# Altium schematic sheet Sheet1.SchDoc
size 381 x 241 mm; SheetNumber: 1; SheetTotal: 5; SPICEModelCacheHRDCRIYR: <root> / <DocumentId>HRDCRIYR</DocumentId> / <CacheFrame Number="0"> / <Model Name="cap" Kind="MDL"> / <Text>*Default semiconductor capacitor / .MODEL CAP C()</Text> / </Model> / </CacheFrame> / </root>
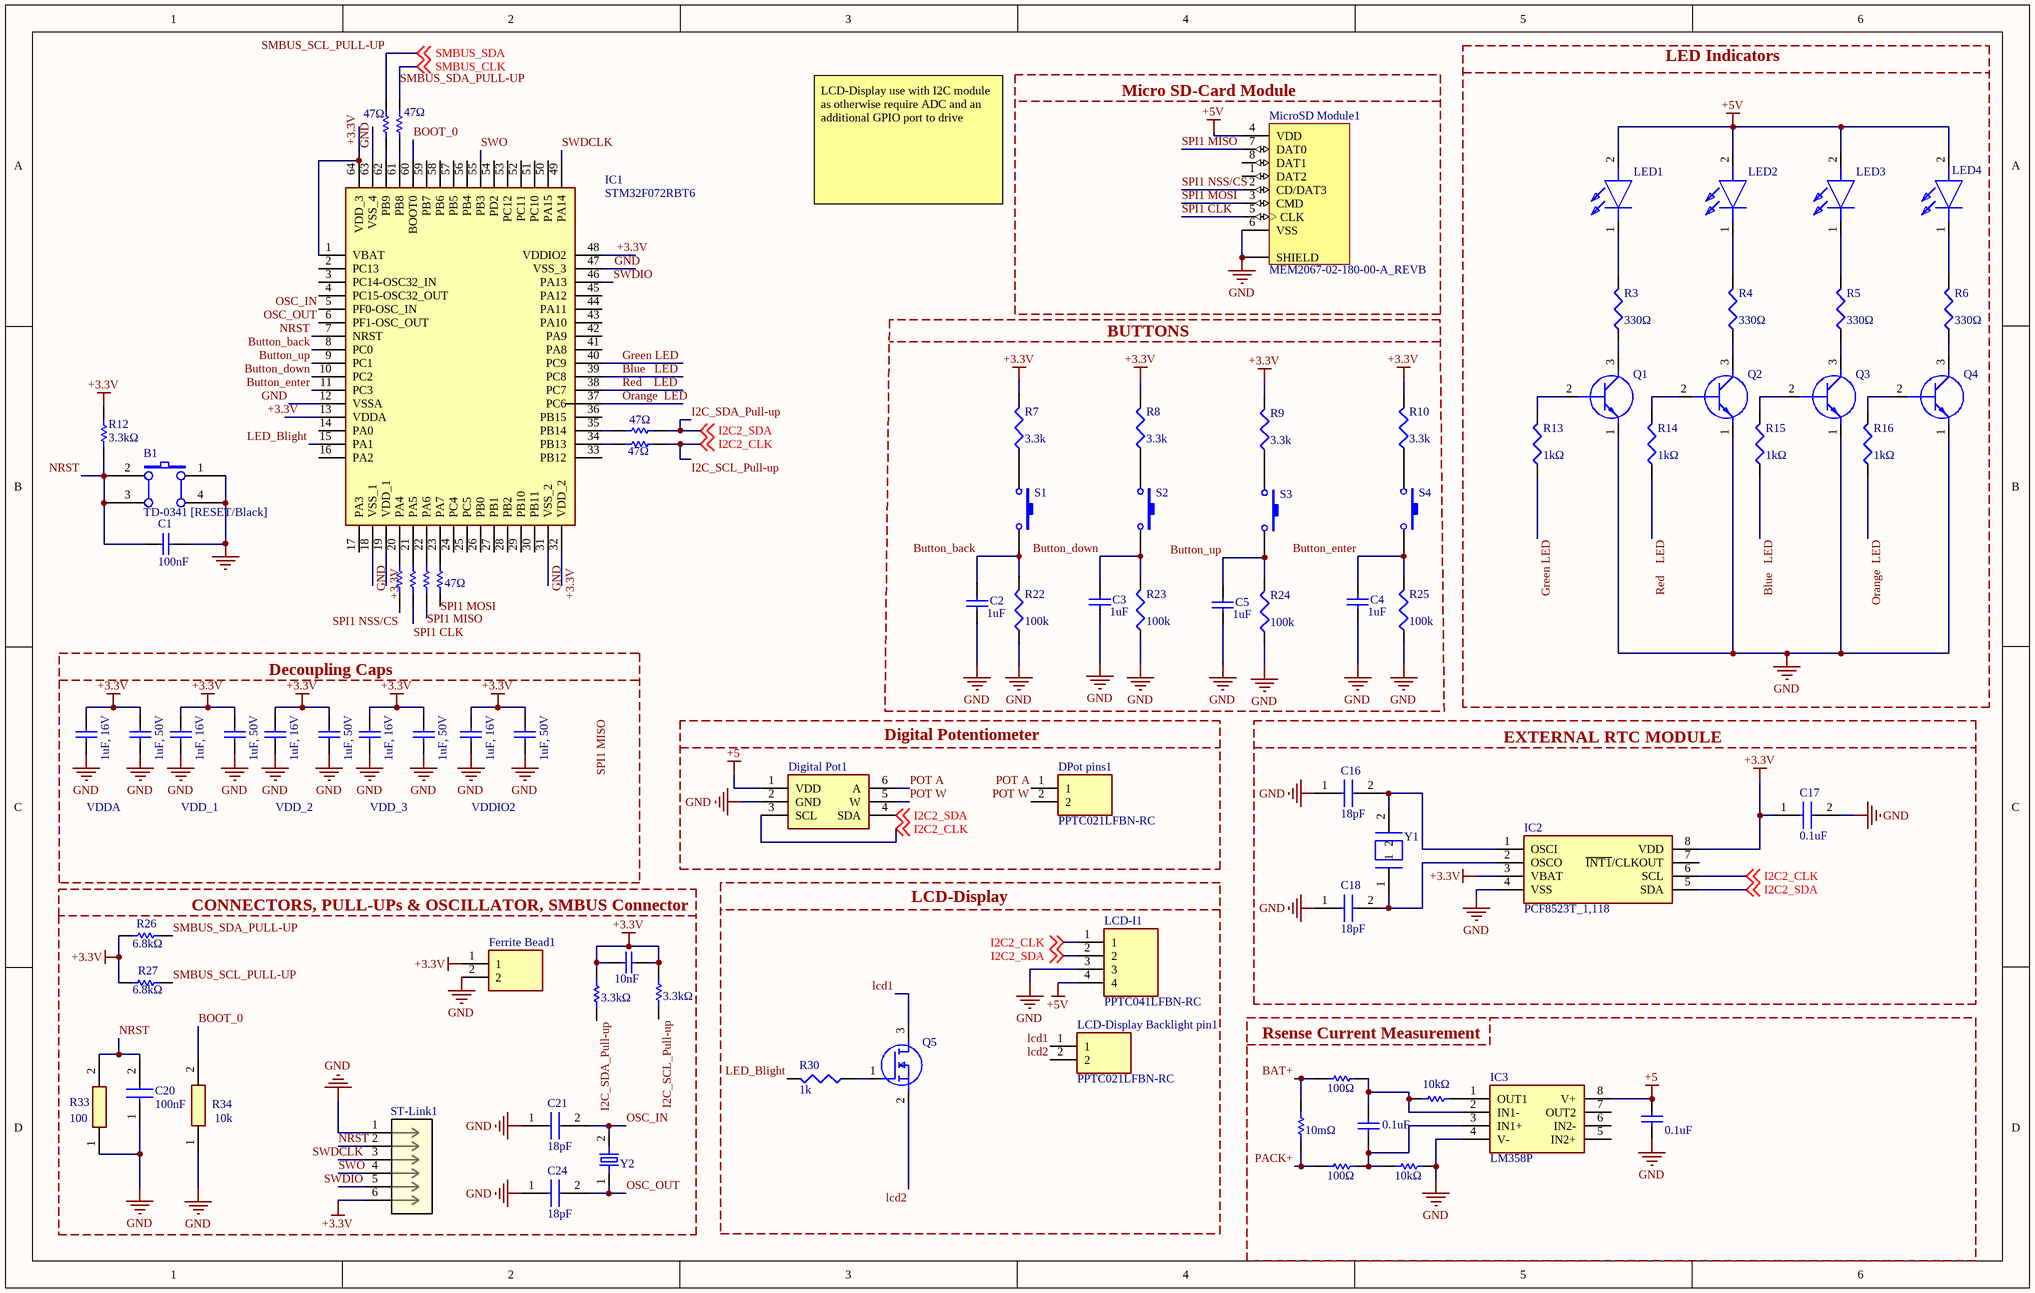
[diagram p0: Sheet1.SchDoc]

## Parts
B1  TD-0341 [RESET/Black]  [PB10]
C1  100nF  [0603C]
C2  value 1uF  [RAD-0.3]  (hidden comment: Cap)
C3  value 1uF  [RAD-0.3]  (hidden comment: Cap)
C4  value 1uF  [RAD-0.3]  (hidden comment: Cap)
C5  value 1uF  [RAD-0.3]  (hidden comment: Cap)
C6  value 1uF, 16V  [RAD-0.3]  (hidden comment: Cap)
C7  value 1uF, 50V  [RAD-0.3]  (hidden comment: Cap)
C8  value 1uF, 16V  [RAD-0.3]  (hidden comment: Cap)
C9  value 1uF, 50V  [RAD-0.3]  (hidden comment: Cap)
C10  value 1uF, 16V  [RAD-0.3]  (hidden comment: Cap)
C11  value 1uF, 50V  [RAD-0.3]  (hidden comment: Cap)
C12  value 1uF, 16V  [RAD-0.3]  (hidden comment: Cap)
C13  value 1uF, 50V  [RAD-0.3]  (hidden comment: Cap)
C14  value 1uF, 16V  [RAD-0.3]  (hidden comment: Cap)
C15  value 1uF, 50V  [RAD-0.3]  (hidden comment: Cap)
C16  18pF  [CAPC3216X180N]
C17  0.1uF  [CAPC3216X180N]
C18  18pF  [CAPC3216X180N]
C19  value 10nF  [RAD-0.3]  (hidden comment: Cap)
C20  100nF  [CAPC3216X180N]
C21  18pF  [CAPC3216X180N]
C22  value 0.1uF  [RAD-0.3]  (hidden comment: Cap)
C23  value 0.1uF  [RAD-0.3]  (hidden comment: Cap)
C24  18pF  [CAPC3216X180N]
Digital_Pot1  AD5247BKSZ10-2RL7  [SOT65P210X110-6N]  (value not drawn)
DPot_pins1  PPTC021LFBN-RC  [RHDR2W80P0X254_1X2_558X254X850P]
Ferrite_Bead1  2506033007Y3  [BEADC1608X110N]  (value not drawn)
IC1  STM32F072RBT6  [QFP50P1200X1200X160-64N]
IC2  PCF8523T_1,118  [SOIC127P600X175-8N]
IC3  LM358P  [DIP794W53P254L959H508Q8N]
LCD-Display_Backlight_pin1  PPTC021LFBN-RC  [RHDR2W80P0X254_1X2_558X254X850P]
LCD-I1  PPTC041LFBN-RC  [RHDR4W80P0X254_1X4_1066X254X850P]
LED1  L-424IDT  [T-1_(3MM)_CYLINDRICAL_LED_LAMP]  (value not drawn)
LED2  L-424IDT  [T-1_(3MM)_CYLINDRICAL_LED_LAMP]  (value not drawn)
LED3  L-424IDT  [T-1_(3MM)_CYLINDRICAL_LED_LAMP]  (value not drawn)
LED4  L-424IDT  [T-1_(3MM)_CYLINDRICAL_LED_LAMP]  (value not drawn)
MicroSD_Module1  MEM2067-02-180-00-A_REVB  [GCT_MEM2067-02-180-00-A_REVB]
Q1  2n3904  [TO-92]  (value not drawn)
Q2  2n3904  [TO-92]  (value not drawn)
Q3  2n3904  [TO-92]  (value not drawn)
Q4  2n3904  [TO-92]  (value not drawn)
Q5  DMG6968UQ-7  [SOT96P240X100-3N]  (value not drawn)
R1  value 47Ω  [AXIAL-0.3]  (hidden comment: Res1)
R2  value 47Ω  [AXIAL-0.3]  (hidden comment: Res1)
R3  value 330Ω  [J1-0603]  (hidden comment: 330)
R4  value 330Ω  [J1-0603]  (hidden comment: 330)
R5  value 330Ω  [J1-0603]  (hidden comment: 330)
R6  value 330Ω  [J1-0603]  (hidden comment: 330)
R7  value 3.3k  [J1-0603]  (hidden comment: Res3)
R8  value 3.3k  [J1-0603]  (hidden comment: Res3)
R9  value 3.3k  [J1-0603]  (hidden comment: Res3)
R10  value 3.3k  [J1-0603]  (hidden comment: Res3)
R11  value 47Ω  [AXIAL-0.3]  (hidden comment: Res1)
R12  value 3.3kΩ  [AXIAL-0.3]  (hidden comment: Res1)
R13  value 1kΩ  [J1-0603]  (hidden comment: Res3)
R14  value 1kΩ  [J1-0603]  (hidden comment: Res3)
R15  value 1kΩ  [J1-0603]  (hidden comment: Res3)
R16  value 1kΩ  [J1-0603]  (hidden comment: Res3)
R17  value 47Ω  [AXIAL-0.3]  (hidden comment: Res1)
R18  Res1  [AXIAL-0.3]  (value not drawn)
R19  Res1  [AXIAL-0.3]  (value not drawn)
R20  Res1  [AXIAL-0.3]  (value not drawn)
R21  value 47Ω  [AXIAL-0.3]  (hidden comment: Res1)
R22  value 100k  [J1-0603]  (hidden comment: Res3)
R23  value 100k  [J1-0603]  (hidden comment: Res3)
R24  value 100k  [J1-0603]  (hidden comment: Res3)
R25  value 100k  [J1-0603]  (hidden comment: Res3)
R26  value 6.8kΩ  [AXIAL-0.3]  (hidden comment: Res1)
R27  value 6.8kΩ  [AXIAL-0.3]  (hidden comment: Res1)
R28  value 3.3kΩ  [AXIAL-0.3]  (hidden comment: Res1)
R29  value 3.3kΩ  [AXIAL-0.3]  (hidden comment: Res1)
R30  value 1k  [J1-0603]  (hidden comment: Res3)
R31  value 100Ω  [AXIAL-0.3]  (hidden comment: Res1)
R32  value 10kΩ  [AXIAL-0.3]  (hidden comment: Res1)
R33  100  [RESC1608X55N]
R34  10k  [RESC1608X55N]
R35  value 10mΩ  [AXIAL-0.3]  (hidden comment: Res1)
R36  value 100Ω  [AXIAL-0.3]  (hidden comment: Res1)
R37  value 10kΩ  [AXIAL-0.3]  (hidden comment: Res1)
S1  SW-PB  [SPST-2]  (value not drawn)
S2  SW-PB  [SPST-2]  (value not drawn)
S3  SW-PB  [SPST-2]  (value not drawn)
S4  SW-PB  [SPST-2]  (value not drawn)
ST-Link1  20021121-00006C4LF  [CONN_20021121-00006C4LF_AMP-M]  (value not drawn)
Y1  ABS07AIG-32.768KHZ-9-1-T  [XTAL320X150X90]  (value not drawn)
Y2  8 MHz ±20ppm  [XTAL500X320X130N]  (value not drawn)

## Blocks framed on the sheet
LED Indicators: LED1-LED4 Q1-Q4 R3-R6 R13-R16
Micro SD-Card Module: MicroSD_Module1
BUTTONS: C2-C5 R7-R10 R22-R25 S1-S4
Decoupling Caps: C6-C15
Digital Potentiometer: Digital_Pot1 DPot_pins1
LCD-Display: LCD-Display_Backlight_pin1 LCD-I1 Q5 R30
CONNECTORS, PULL-UPs & OSCILLATOR, SMBUS Connector: C19-C21 C24 Ferrite_Bead1 R26-R29 R33 R34 ST-Link1 Y2

## Nets
+3.3V: C6.1 C7.1 C8.1 C9.1 C10.1 C11.1 C12.1 C13.1 C14.1 C15.1 C17.1 C19.1 C19.2 Ferrite_Bead1.1 IC1.1(VBAT) IC1.13(VDDA) IC1.19(VDD_1) IC1.32(VDD_2) IC1.48(VDDIO2) IC1.64(VDD_3) IC2.3(VBAT) IC2.8(VDD) R7.2 R8.2 R9.2 R10.2 R12.2 R26.1 R27.1 R28.1 R29.1 ST-Link1.6
+5: C22.1 Digital_Pot1.1(VDD) IC3.8(V+)
+5V: LCD-I1.4 LED1.2(A) LED2.2(A) LED3.2(A) LED4.2(A) MicroSD_Module1.4(VDD)
GND: B1.1(A0) B1.4(A1) C1.1 C2.1 C3.1 C4.1 C5.1 C6.2 C7.2 C8.2 C9.2 C10.2 C11.2 C12.2 C13.2 C14.2 C15.2 C16.1 C17.2 C18.1 C20.1 C21.1 C22.2 C24.1 Digital_Pot1.2(GND) Ferrite_Bead1.2 IC1.12(VSSA) IC1.18(VSS_1) IC1.31(VSS_2) IC1.47(VSS_3) IC1.63(VSS_4) IC2.4(VSS) IC3.4(V-) LCD-I1.3 MicroSD_Module1.6(VSS) MicroSD_Module1.9(SHIELD) MicroSD_Module1.10(SHIELD) MicroSD_Module1.11(SHIELD) MicroSD_Module1.12(SHIELD) Q1.1(E) Q2.1(E) Q3.1(E) Q4.1(E) R22.1 R23.1 R24.1 R25.1 R33.1 R34.1 R37.1 ST-Link1.1
BAT+: R31.2 R35.2
Blue   LED: IC1.39(PC8) R15.1
BOOT_0: IC1.60(BOOT0) R34.2
Button_back: C2.2 IC1.8(PC0) R22.2 S1.2
Button_down: C3.2 IC1.10(PC2) R23.2 S2.2
Button_enter: C4.2 IC1.11(PC3) R25.2 S4.2
Button_up: C5.2 IC1.9(PC1) R24.2 S3.2
Green LED: IC1.40(PC9) R13.1
I2C_SCL_Pull-up: Digital_Pot1.3(SCL) IC2.6(SCL) LCD-I1.1 R17.2 R29.2 ; off-sheet I2C2_CLK  [also labelled I2C2_CLK]
I2C_SDA_Pull-up: Digital_Pot1.4(SDA) IC2.5(SDA) LCD-I1.2 R11.2 R28.2 ; off-sheet I2C2_SDA  [also labelled I2C2_SDA]
lcd1: LCD-Display_Backlight_pin1.1 Q5.3(D)
lcd2: LCD-Display_Backlight_pin1.2 Q5.2(S)
LED_Blight: IC1.15(PA1) R30.2
NRST: B1.2(B0) B1.3(B1) C1.2 C20.2 IC1.7(NRST) R12.1 R33.2 ST-Link1.2
Orange  LED: IC1.37(PC6) R16.1
OSC_IN: C21.2 IC1.5(PF0-OSC_IN) Y2.2
OSC_OUT: C24.2 IC1.6(PF1-OSC_OUT) Y2.1
PACK+: R35.1 R36.2
POT A: Digital_Pot1.6(A) DPot_pins1.1
POT W: Digital_Pot1.5(W) DPot_pins1.2
Red    LED: IC1.38(PC7) R14.1
SMBUS_SCL_PULL-UP: R1.2 R27.2 ; off-sheet SMBUS_SDA  [also labelled SMBUS_SDA]
SMBUS_SDA_PULL-UP: R2.2 R26.2 ; off-sheet SMBUS_CLK  [also labelled SMBUS_CLK]
SPI1 CLK: MicroSD_Module1.5(CLK) R19.1
SPI1 MISO: MicroSD_Module1.7(DAT0) R20.1
SPI1 MOSI: MicroSD_Module1.3(CMD) R21.1
SPI1 NSS/CS: MicroSD_Module1.2(CD/DAT3) R18.1
SWDCLK: IC1.49(PA14) ST-Link1.3
SWDIO: IC1.46(PA13) ST-Link1.5
SWO: IC1.55(PB3) ST-Link1.4
NetC16_2: C16.2 IC2.1(OSCI) Y1.2
NetC18_2: C18.2 IC2.2(OSCO) Y1.1
NetC23_1: C23.1 IC3.3(IN1+) R36.1 R37.2
NetC23_2: C23.2 IC3.2(IN1-) R31.1 R32.2
NetIC1_20: IC1.20(PA4) R18.2
NetIC1_21: IC1.21(PA5) R19.2
NetIC1_22: IC1.22(PA6) R20.2
NetIC1_23: IC1.23(PA7) R21.2
NetIC1_34: IC1.34(PB13) R17.1
NetIC1_35: IC1.35(PB14) R11.1
NetIC1_61: IC1.61(PB8) R2.1
NetIC1_62: IC1.62(PB9) R1.1
NetIC3_1: IC3.1(OUT1) R32.1
NetLED1_1: LED1.1(K) R3.2
NetLED2_1: LED2.1(K) R4.2
NetLED3_1: LED3.1(K) R5.2
NetLED4_1: LED4.1(K) R6.2
NetQ1_2: Q1.2(B) R13.2
NetQ1_3: Q1.3(C) R3.1
NetQ2_2: Q2.2(B) R14.2
NetQ2_3: Q2.3(C) R4.1
NetQ3_2: Q3.2(B) R15.2
NetQ3_3: Q3.3(C) R5.1
NetQ4_2: Q4.2(B) R16.2
NetQ4_3: Q4.3(C) R6.1
NetQ5_1: Q5.1(G) R30.1
NetR7_1: R7.1 S1.1
NetR8_1: R8.1 S2.1
NetR9_1: R9.1 S3.1
NetR10_1: R10.1 S4.1

Not connected (* = marked no-connect by the designer): IC1 2(PC13) 3(PC14-OSC32_IN) 4(PC15-OSC32_OUT) 14(PA0) 16(PA2) 17(PA3) 24(PC4) 25(PC5) 26(PB0) 27(PB1) 28(PB2) 29(PB10) 30(PB11) 33(PB12) 36(PB15) 41(PA8) 42(PA9) 43(PA10) 44(PA11) 45(PA12) 50(PA15) 51(PC10) 52(PC11) 53(PC12) 54(PD2) 56(PB4) 57(PB5) 58(PB6) 59(PB7); IC2 7(~{INT1}/CLKOUT); IC3 5(IN2+) 6(IN2-) 7(OUT2); MicroSD_Module1 1(DAT2) 8(DAT1)

## Notes on the sheet
- LCD-Display use with I2C module as otherwise require ADC and an additional GPIO port to drive
- EXTERNAL RTC MODULE
- VDDA
- VDD_1
- VDD_2
- VDD_3
- VDDIO2
- Rsense Current Measurement
- (near IC3) Noise can propagate into analog circuitry through the power pins of the circuit as a whole, as well as the operational amplifier. Bypass capacitors are used to reduce the coupled noise by providing low-impedance power sources local to the analog circuitry.
- Labels drawn without touching a wire or pin: SPI1 MISO

## Library data of the parts
B1 = SW PUSHBUTTON: SE PUSHBUTTON
C1 = CAP: Capacitor; Value: 100pF; Published: 8-Jun-2000; Revision: July-2002: Re-released for DXP Platform.; Publisher: Altium Limited
C2-C15 C19 C22 C23 = Cap: Capacitor; Published: 8-Jun-2000; LatestRevisionDate: 17-Jul-2002; LatestRevisionNote: Re-released for DXP Platform.; PackageReference: RAD-0.3; Publisher: Altium Limited; PackageDescription: Radial Cap, Thru-Hole; 2 Leads; 0.3 in Pin Spacing
C16-C18 C20 C21 C24 = GRM31CD80J107MEA8L: Capacitor; Manufacturer_Name: Murata Electronics; Height: 1.8mm; Manufacturer_Part_Number: GRM31CD80J107MEA8L; Mouser Part Number: 81-GRM31CD80J107MA8L; Mouser Price/Stock: https://www.mouser.co.uk/ProductDetail/Murata-Electronics/GRM31CD80J107MEA8L?qs=DPoM0jnrROWnWfPYsqocbw%3D%3D
Digital_Pot1 = AD5247BKSZ10-2RL7: Integrated Circuit; Manufacturer_Name: Analog Devices; Datasheet Link: https://www.analog.com/media/en/technical-documentation/data-sheets/AD5247.pdf; Height: 1.1mm; Manufacturer_Part_Number: AD5247BKSZ10-2RL7; Mouser Part Number: 584-AD5247BKSZ10-2R7; Mouser Price/Stock: https://www.mouser.co.uk/ProductDetail/Analog-Devices/AD5247BKSZ10-2RL7?qs=NmRFExCfTkEuDqKDhhBFmQ%3D%3D; Arrow Part Number: AD5247BKSZ10-2RL7; Arrow Price/Stock: https://www.arrow.com/en/products/ad5247bksz10-2rl7/analog-devices
DPot_pins1 LCD-Display_Backlight_pin1 = PPTC021LFBN-RC: Connector; Manufacturer_Name: Sullins; Datasheet Link: http://www.sullinscorp.com/drawings/78_P(N)PxCxxxLFBN-RC,_10492-H.pdf; Height: 8.5mm; Manufacturer_Part_Number: PPTC021LFBN-RC
Ferrite_Bead1 = 2506033007Y3: Ferrite Bead / 100 MHz, 3A, 40 Ohm; Manufacturer_Name: Fair-Rite; Datasheet Link: https://www.fair-rite.com/product/chip-beads-2506033007y3/; Height: 1.1mm; Manufacturer_Part_Number: 2506033007Y3; Mouser Part Number: 623-2506033007Y3; Mouser Price/Stock: https://www.mouser.co.uk/ProductDetail/Fair-Rite/2506033007Y3?qs=paL1wOLBYNf20sf8jiNk7A%3D%3D; Arrow Part Number: 2506033007Y3; Arrow Price/Stock: https://www.arrow.com/en/products/2506033007y3/fair-rite-products
IC1 = STM32F072RBT6: Integrated Circuit; Manufacturer_Name: STMicroelectronics; Datasheet Link: http://www.st.com/st-web-ui/static/active/en/resource/technical/document/datasheet/DM00090510.pdf; Height: 1.6mm; Manufacturer_Part_Number: STM32F072RBT6; Mouser Part Number: 511-STM32F072RBT6; Mouser Price/Stock: https://www.mouser.co.uk/ProductDetail/STMicroelectronics/STM32F072RBT6?qs=xf9JV0PLFEcuk6sTlnutaw%3D%3D; Arrow Part Number: STM32F072RBT6; Arrow Price/Stock: https://www.arrow.com/en/products/stm32f072rbt6/stmicroelectronics
IC2 = PCF8523T_1,118: Integrated Circuit; Manufacturer_Name: NXP; Manufacturer_Part_Number: PCF8523T/1,118; Datasheet Link: http://www.nxp.com/docs/en/data-sheet/PCF8523.pdf; Height: 1.75mm; Mouser Part Number: 771-PCF8523T/1118; Mouser Price/Stock: https://www.mouser.co.uk/ProductDetail/NXP-Semiconductors/PCF8523T-1118?qs=beN0Cyoe8YmmXShRMIPCwg%3D%3D; Arrow Part Number: PCF8523T/1,118; Arrow Price/Stock: https://www.arrow.com/en/products/pcf8523t1118/nxp-semiconductors?region=nac
IC3 = LM358P: Integrated Circuit; Manufacturer_Name: Texas Instruments; Datasheet Link: http://www.ti.com/lit/ds/symlink/lm358a.pdf; Height: 5.08mm; Manufacturer_Part_Number: LM358P; Mouser Part Number: 595-LM358P; Mouser Price/Stock: https://www.mouser.co.uk/ProductDetail/Texas-Instruments/LM358P?qs=X1HXWTtiZ0QtOTT8%252BVnsyw%3D%3D; Arrow Part Number: LM358P; Arrow Price/Stock: https://www.arrow.com/en/products/lm358p/texas-instruments?region=nac
LCD-I1 = PPTC041LFBN-RC: Connector; Manufacturer_Name: Sullins; Datasheet Link: http://www.sullinscorp.com/drawings/78_P(N)PxCxxxLFBN-RC,_10492-H.pdf; Height: 8.5mm; Manufacturer_Part_Number: PPTC041LFBN-RC
LED1-LED4 = L-424IDT: LED; Manufacturer_Name: Kingbright; Datasheet Link: https://componentsearchengine.com/Datasheets/2/L-424IDT.pdf; Manufacturer_Part_Number: L-424IDT; Mouser Part Number: N/A; Mouser Price/Stock: https://www.mouser.com/Search/Refine.aspx?Keyword=N%2FA; Arrow Part Number: L-424IDT; Arrow Price/Stock: https://www.arrow.com/en/products/l-424idt/kingbright
MicroSD_Module1 = MEM2067-02-180-00-A_REVB: 8 Position Card Connector microSDâ„¢ Surface Mount, Right Angle Gold; MF: Global Connector Technology; Package: None; Value: *; Price: None; MP: MEM2067-02-180-00-A; SnapEDA_Link: https://www.snapeda.com/parts/MEM2067-02-180-00-A/Global%20Connector%20Technology/view-part/779218/?ref=snap; Availability: Unavailable
Q1-Q4 = 2n3904: Transistor BJT NPN; Manufacturer_Name: STMicroelectronics; Datasheet Link: https://datasheet.datasheetarchive.com/originals/distributors/Datasheets-5/DSA-93219.pdf; Manufacturer_Part_Number: 2n3904; Mouser Part Number: 511-2N3904; Mouser Price/Stock: https://www.mouser.co.uk/ProductDetail/STMicroelectronics/2N3904?qs=ljbEvF4DwOMFlSOlAhVGRg%3D%3D
Q5 = DMG6968UQ-7: MOSFET (N-Channel); Manufacturer_Name: Diodes Inc.; Datasheet Link: https://www.arrow.com/en/products/dmg6968uq-7/diodes-incorporated; Height: 1mm; Manufacturer_Part_Number: DMG6968UQ-7; Mouser Part Number: 621-DMG6968UQ-7; Mouser Price/Stock: https://www.mouser.co.uk/ProductDetail/Diodes-Incorporated/DMG6968UQ-7?qs=MNIFWdyJgboErGB0%2FFpP4Q%3D%3D; Arrow Part Number: DMG6968UQ-7; Arrow Price/Stock: https://www.arrow.com/en/products/dmg6968uq-7/diodes-incorporated
R1 R2 R11 R12 R17 R21 R26-R29 R31 R32 R35-R37 = Res1: Resistor; Published: 8-Jun-2000; LatestRevisionDate: 17-Jul-2002; LatestRevisionNote: Re-released for DXP Platform.; PackageReference: AXIAL-0.3; Publisher: Altium Limited; PackageDescription: Axial Device, Thru-Hole; 2 Leads; 0.3 in Pin Spacing
R3-R10 R13-R16 R22-R25 R30 = Res3: Resistor; Published: 8-Jun-2000; LatestRevisionDate: 29-May-2009; LatestRevisionNote: IPC-7351 Footprint Added.; PackageReference: J1-0603; Publisher: Altium Limited; PackageDescription: Chip Resistor
R18 = Res1: Resistor; Value: 1kΩ; Published: 8-Jun-2000; LatestRevisionDate: 17-Jul-2002; LatestRevisionNote: Re-released for DXP Platform.; PackageReference: AXIAL-0.3; Publisher: Altium Limited; PackageDescription: Axial Device, Thru-Hole; 2 Leads; 0.3 in Pin Spacing
R19 R20 = Res1: Resistor; Value: 47Ω; Published: 8-Jun-2000; LatestRevisionDate: 17-Jul-2002; LatestRevisionNote: Re-released for DXP Platform.; PackageReference: AXIAL-0.3; Publisher: Altium Limited; PackageDescription: Axial Device, Thru-Hole; 2 Leads; 0.3 in Pin Spacing
R33 R34 = CRG0603F470R: Resistor; Manufacturer_Name: TE Connectivity; Datasheet Link: https://datasheet.datasheetarchive.com/originals/distributors/DKDS-21/401698.pdf; Height: 0.55mm; Manufacturer_Part_Number: CRG0603F470R; Mouser Part Number: 279-CRG0603F470R; Mouser Price/Stock: https://www.mouser.co.uk/ProductDetail/TE-Connectivity-Holsworthy/CRG0603F470R?qs=VHcS2MTj4gZ9vO%2FWGoSTFA%3D%3D; Arrow Part Number: CRG0603F470R; Arrow Price/Stock: https://www.arrow.com/en/products/crg0603f470r/te-connectivity?region=nac
S1-S4 = SW-PB: Switch; Published: 24-Mar-1999; LatestRevisionDate: 17-Jul-2002; LatestRevisionNote: Re-released for DXP Platform.; PackageReference: SPST-2; Publisher: Altium Limited; PackageDescription: Switch; 2 Leads
ST-Link1 = 20021121-00006C4LF: ST-Link; Mfr_Name: Amphenol ICC; Manufacturer_Part_Number: 20021121-00006C4LF; Copyright: Copyright (C) 2022 Ultra Librarian. All rights reserved.; RefDes: RefDes; Type: DEV
Y1 = ABS07AIG-32.768KHZ-9-1-T: 32.768kHz Â±10ppm Crystal 9pF 80 kOhms 2-SMD, No Lead; MF: Abracon; Package: SMD-2 Abracon; MP: ABS07AIG-32.768KHZ-9-1-T; SnapEDA_Link: https://www.snapeda.com/parts/ABS07AIG-32.768KHZ-9-1-T/Abracon%20LLC/view-part/588516/?ref=snap; Price: None; Value: *; Availability: Unavailable
Y2 = ABM3-16.000MHZ-D2Y-T: 16MHz Â±20ppm Crystal 18pF 40 Ohms 2-SMD, No Lead; MF: Abracon; SnapEDA_Link: https://www.snapeda.com/parts/ABM3-16.000MHZ-D2Y/Abracon/view-part/1217081/?ref=snap; MP: ABM3-16.000MHZ-D2Y; Availability: Unavailable; Package: SMD-2 Abracon; Price: None; Value: *